# EAGLE design tick-display-mk-4 (EAGLE 6.5.0)
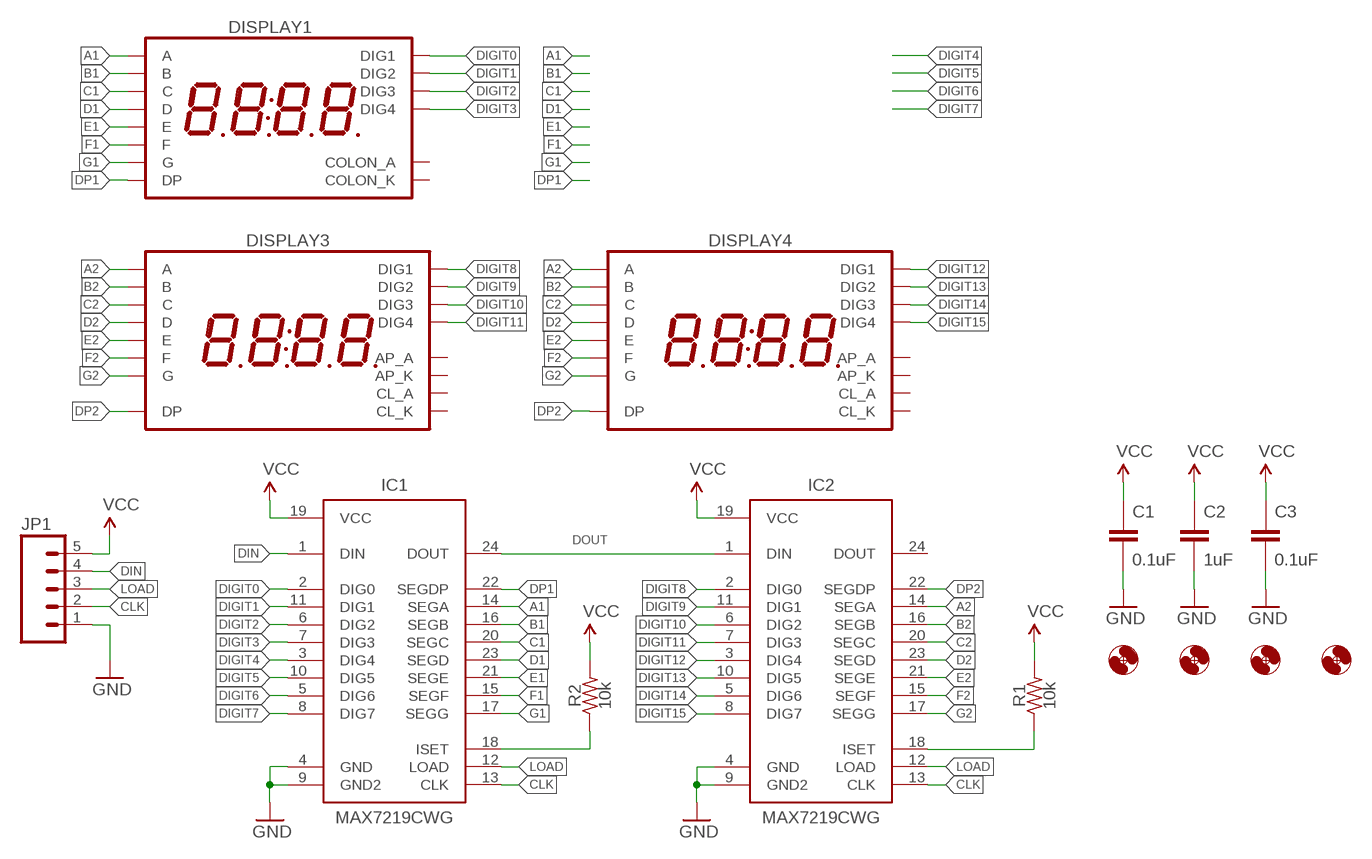
[diagram p0: schematic, sheet 1]

## Parts
C1  0.1uF  CAPACITOR-CERAMIC025-024X044  [C025-024X044]
C2  1uF  CAPACITOR-CERAMIC025-024X044  [C025-024X044]
C3  0.1uF  CAPACITOR-CERAMIC025-024X044  [C025-024X044]
DISPLAY1  7SEG_4DIGIT_COLON14.2MM-CC  [7SEG_4DIG_0.56IN_14MM_ADAFRUIT]
DISPLAY3  7SEG_4DIGIT_COLON_APOS  [7SEG_4DIG_10MM]
DISPLAY4  7SEG_4DIGIT_COLON_APOS  [7SEG_4DIG_10MM]
H1  HOLE#2  [HOLE-#2]
H2  HOLE#2  [HOLE-#2]
H3  HOLE#2  [HOLE-#2]
H4  HOLE#2  [HOLE-#2]
IC1  MAX7219CWG  MAX7219SOIC-W  [SO24W]
IC2  MAX7219CWG  MAX7219SOIC-W  [SO24W]
JP1  M05JST-PH-VERT-PTH  [JST-5-PH-VERT-PTH]
R1  10k  RESISTORPTH-AXIAL-5.08MM  [RESISTOR-AXIAL-PTH-5.08MM]
R2  10k  RESISTORPTH-AXIAL-5.08MM  [RESISTOR-AXIAL-PTH-5.08MM]

## Nets
A1: DISPLAY1.P$13(A) IC1.14(SEGA)
A2: DISPLAY3.14(A) DISPLAY4.14(A) IC2.14(SEGA)
B1: DISPLAY1.P$9(B) IC1.16(SEGB)
B2: DISPLAY3.16(B) DISPLAY4.16(B) IC2.16(SEGB)
C1: DISPLAY1.P$4(C) IC1.20(SEGC)
C2: DISPLAY3.13(C) DISPLAY4.13(C) IC2.20(SEGC)
CLK: IC1.13(CLK) IC2.13(CLK) JP1.2
D1: DISPLAY1.P$2(D) IC1.23(SEGD)
D2: DISPLAY3.3(D) DISPLAY4.3(D) IC2.23(SEGD)
DIGIT0: DISPLAY1.P$14(DIG1) IC1.2(DIG0)
DIGIT1: DISPLAY1.P$11(DIG2) IC1.11(DIG1)
DIGIT2: DISPLAY1.P$10(DIG3) IC1.6(DIG2)
DIGIT3: DISPLAY1.P$6(DIG4) IC1.7(DIG3)
DIGIT4: IC1.3(DIG4)
DIGIT5: IC1.10(DIG5)
DIGIT6: IC1.5(DIG6)
DIGIT7: IC1.8(DIG7)
DIGIT8: DISPLAY3.1(DIG1) IC2.2(DIG0)
DIGIT9: DISPLAY3.2(DIG2) IC2.11(DIG1)
DIGIT10: DISPLAY3.6(DIG3) IC2.6(DIG2)
DIGIT11: DISPLAY3.8(DIG4) IC2.7(DIG3)
DIGIT12: DISPLAY4.1(DIG1) IC2.3(DIG4)
DIGIT13: DISPLAY4.2(DIG2) IC2.10(DIG5)
DIGIT14: DISPLAY4.6(DIG3) IC2.5(DIG6)
DIGIT15: DISPLAY4.8(DIG4) IC2.8(DIG7)
DIN: IC1.1(DIN) JP1.4
DOUT: IC1.24(DOUT) IC2.1(DIN)
DP1: DISPLAY1.P$3(DP) IC1.22(SEGDP)
DP2: DISPLAY3.7(DP) DISPLAY4.7(DP) IC2.22(SEGDP)
E1: DISPLAY1.P$1(E) IC1.21(SEGE)
E2: DISPLAY3.5(E) DISPLAY4.5(E) IC2.21(SEGE)
F1: DISPLAY1.P$12(F) IC1.15(SEGF)
F2: DISPLAY3.11(F) DISPLAY4.11(F) IC2.15(SEGF)
G1: DISPLAY1.P$5(G) IC1.17(SEGG)
G2: DISPLAY3.15(G) DISPLAY4.15(G) IC2.17(SEGG)
GND: C1.2 C2.2 C3.2 IC1.4(GND) IC1.9(GND2) IC2.4(GND) IC2.9(GND2) JP1.1
LOAD: IC1.12(LOAD) IC2.12(LOAD) JP1.3
N$2: IC1.18(ISET) R2.P$1
N$13: IC2.18(ISET) R1.P$1
VCC: C1.1 C2.1 C3.1 IC1.19(VCC) IC2.19(VCC) JP1.5 R1.P$2 R2.P$2
Unconnected: DISPLAY1.P$7(COLON_K) DISPLAY1.P$8(COLON_A) DISPLAY3.4(CL_A) DISPLAY3.9(AP_K) DISPLAY3.10(AP_A) DISPLAY3.12(CL_K) DISPLAY4.4(CL_A) DISPLAY4.9(AP_K) DISPLAY4.10(AP_A) DISPLAY4.12(CL_K) IC2.24(DOUT)

## Library data of the parts
C1-C3 = A_butts:CAPACITOR-CERAMIC: CAPACITOR, European symbol
DISPLAY1 = A_butts:7SEG_4DIGIT_COLON
DISPLAY3 DISPLAY4 = A_butts:7SEG_4DIGIT_COLON_APOS
H1-H4 = A_butts:HOLE: MOUNTING HOLE with drill center marker
IC1 IC2 = A_butts:MAX7219: 8-digit, 8-segment LED display driver, serial input
JP1 = A_butts:M05: Header 5 Standard 5-pin 0.1" header. Use with straight break away headers (SKU : PRT-00116), right angle break away headers (PRT-00553), swiss pins (PRT-00743), machine pins (PRT-00117), and female headers (PRT-00115). Molex polarized connector foot print use with SKU : PRT-08230 with associated crimp pins and housings.
R1 R2 = A_butts:RESISTOR: RESISTOR, American symbol

## Board
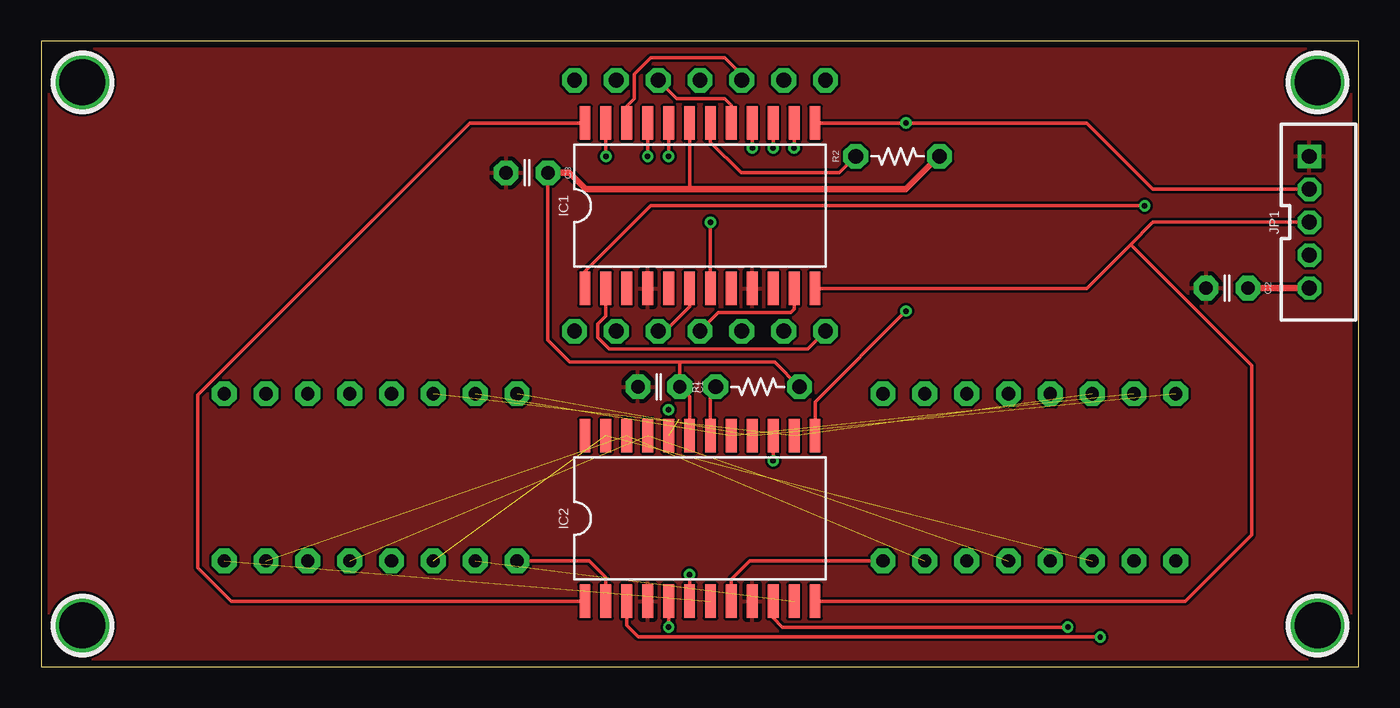
[diagram p1: board, top side]
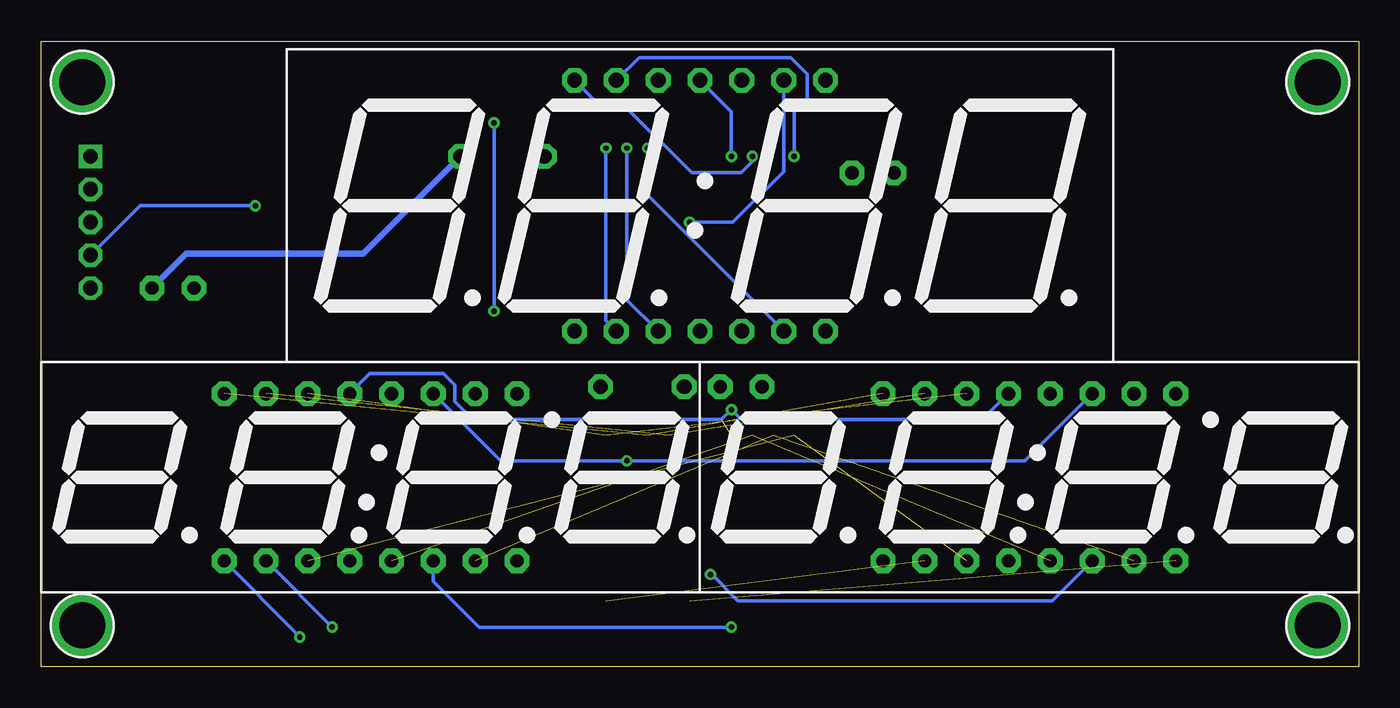
[diagram p2: board, bottom side, seen from below]

Size 80 x 38 mm. Coordinates in mm from the lower left corner, seen from the top.
Outline: 80,0 80,38 0,38 0,0 80,0
Copper layers (1*16): Top 0.0356mm / dielectric 1.5011mm / Bottom 0.0356mm
Design rules "LaenPCBOrder2": minimum track width 6mil, minimum drill 13mil, track to track 6mil, track to pad 6mil, pad to pad 6mil, via to via 6mil, smd to smd 6mil, copper to edge 15mil, drill to drill 6mil, minimum pad ring 7mil, minimum via ring 7mil, stop-mask expansion 3mil, vias tented up to drill 20mil, thermal gap 10mil

### Footprints (pad centres in the part's own frame; a part is rotated, then mirrored left to right if it is on the bottom)
C025-024X044 = drill 0.813 pad 1.5 octagon: 1 -1.27,0; 2 1.27,0
7SEG_4DIG_0.56IN_14MM_ADAFRUIT = drill 0.9 pad 1.5 octagon: P$1 -7.62,7.62; P$2 -5.08,7.62; P$3 -2.54,7.62; P$4 0,7.62; P$5 2.54,7.62; P$6 5.08,7.62; P$7 7.62,7.62; P$8 7.62,-7.62; P$9 5.08,-7.62; P$10 2.54,-7.62; P$11 0,-7.62; P$12 -2.54,-7.62; P$13 -5.08,-7.62; P$14 -7.62,-7.62
7SEG_4DIG_10MM = drill 0.8 pad 1.5 octagon: 1 -8.89,-5.08; 2 -6.35,-5.08; 3 -3.81,-5.08; 4 -1.27,-5.08; 5 1.27,-5.08; 6 3.81,-5.08; 7 6.35,-5.08; 8 8.89,-5.08; 9 8.89,5.08; 10 6.35,5.08; 11 3.81,5.08; 12 1.27,5.08; 13 -1.27,5.08; 14 -3.81,5.08; 15 -6.35,5.08; 16 -8.89,5.08
HOLE-#2 = drill 2.8 pad 3.81: P$1 0,0
SO24W = smd 0.66 x 2.032: 1 -6.985,-5.029; 2 -5.715,-5.029; 3 -4.445,-5.029; 4 -3.175,-5.029; 5 -1.905,-5.029; 6 -0.635,-5.029; 7 0.635,-5.029; 8 1.905,-5.029; 9 3.175,-5.029; 10 4.445,-5.029; 11 5.715,-5.029; 12 6.985,-5.029; 13 6.985,5.029; 14 5.715,5.029; 15 4.445,5.029; 16 3.175,5.029; 17 1.905,5.029; 18 0.635,5.029; 19 -0.635,5.029; 20 -1.905,5.029; 21 -3.175,5.029; 22 -4.445,5.029; 23 -5.715,5.029; 24 -6.985,5.029
JST-5-PH-VERT-PTH = drill 0.9 pad 1.422 square: 1 -4,0 | drill 0.9 pad 1.422 octagon: 2 -2,0; 3 0,0; 4 2,0; 5 4,0
RESISTOR-AXIAL-PTH-5.08MM = drill 0.9 pad 1.5 octagon: P$1 -2.54,0; P$2 2.54,0

### Placement (x,y rotation side)
C1  37.5,17 180 top
C2  72,23 180 top
C3  29.5,30 180 top
DISPLAY1  40,28 0 bottom
DISPLAY3  20,11.5 0 bottom
DISPLAY4  60,11.5 0 bottom
H1  77.5,35.5 0 top
H2  77.5,2.5 0 top
H3  2.5,2.5 0 top
H4  2.5,35.5 0 top
IC1  40,28 0 top
IC2  40,9 0 top
JP1  77,27 270 top
R1  43.5,17 0 top
R2  52,31 0 top

### Tracks (layer width: path | path; a pad name or v marks a point on that pad's centre or on a via)
A1  (via drill 0.33)
  Top 0.2: IC1.14 v45.72,31.5
  Bottom 0.2: v45.72,31.5 45.72,21.02 DISPLAY1.P$13
A2  (2 unrouted)
B1  (via drill 0.33)
  Top 0.2: IC1.16 v43.17,31.5
  Bottom 0.2: v43.17,31.5 43.17,28.64 DISPLAY1.P$9
B2  (2 unrouted)
C1  (via drill 0.33)
  Top 0.2: IC1.20 v38.09,31
  Bottom 0.2: v38.09,31 38.09,33.72 DISPLAY1.P$4
C2  (via drill 0.33)  (1 unrouted)
  Bottom 0.2: DISPLAY3.13 22.85,15 37.5,15 v38.09,15.6 v38.1,15.6 38.7,15 53.8,15 54.9,16.1 54.9,17.1 55.6,17.8 60.05,17.8 DISPLAY4.13
CLK  (via drill 0.33)
  Top 0.2: IC1.13 v52.5,33.03 63.47,33.03 67.5,29 JP1.2 | IC2.13 46.98,16.09 v52.5,21.6
  Bottom 0.2: v52.5,21.6 v52.5,33.03
D1  (via drill 0.33)
  Top 0.2: IC1.23 v34.28,31
  Bottom 0.2: v34.28,31 34.28,33.72 33.5,34.5 33.5,36 34.5,37 43.7,37 DISPLAY1.P$2
D2  (2 unrouted)
DIGIT0
  Top 0.2: IC1.2 34.28,21.29 33.8,20.8 33.8,20 34.5,19.3 46.54,19.3 DISPLAY1.P$14
DIGIT1
  Top 0.2: IC1.11 45.72,21.71 45.5,21.5 41.12,21.5 DISPLAY1.P$11
DIGIT2
  Top 0.2: IC1.6 39.37,21.86 37.88,20.38 DISPLAY1.P$10
DIGIT3  (via drill 0.33)
  Top 0.2: IC1.7 v40.63,27
  Bottom 0.2: DISPLAY1.P$6 34.92,30.08 38,27 v40.63,27
DIGIT8
  Top 0.2: DISPLAY3.1 33.28,6.42 34.28,5.42 IC2.2
DIGIT9  (1 unrouted)
DIGIT10  (via drill 0.33)
  Top 0.2: IC2.6 v39.37,5.6
  Bottom 0.2: v39.37,5.6 39.3,5.6 37.7,4 18.61,4 DISPLAY3.6
DIGIT11  (1 unrouted)
DIGIT12  (via drill 0.33)
  Top 0.2: IC2.3 35.55,2.5 36.26,1.8 v64.3,1.8
  Bottom 0.2: v64.3,1.8 64.5,2.03 DISPLAY4.1
DIGIT13  (via drill 0.33)
  Top 0.2: IC2.10 44.45,2.96 45,2.4 v62.33,2.4
  Bottom 0.2: v62.33,2.4 DISPLAY4.2
DIGIT14  (via drill 0.33)
  Top 0.2: v38.1,2.4 IC2.5
  Bottom 0.2: DISPLAY4.6 56.19,5.19 53.4,2.4 v38.1,2.4
DIGIT15
  Top 0.2: IC2.8 41.91,5.3 43.02,6.42 DISPLAY4.8
DIN  (via drill 0.33)
  Top 0.2: IC1.1 33.02,24.02 37,28 v67,28
  Bottom 0.2: v67,28 74,28 JP1.4
DOUT
  Top 0.2: IC1.24 26.03,33.03 9.5,16.5 9.5,6 11.53,3.97 IC2.1
DP1
  Top 0.2: IC1.22 35.55,34.05 36,34.5 36,36 37,37 41.5,37 42.5,36 42.5,35.66 DISPLAY1.P$3
DP2  (2 unrouted)
E1  (via drill 0.33)
  Top 0.2: IC1.21 v36.83,31
  Bottom 0.2: v36.83,31 36.83,30.68 37.5,30 40.5,30 44.5,34 46,34 DISPLAY1.P$1
E2  (2 unrouted)
F1  (via drill 0.33)
  Top 0.2: IC1.15 v44.45,31.5
  Bottom 0.2: v44.45,31.5 44.45,22.29 DISPLAY1.P$12
F2  (via drill 0.33)
  Top 0.2: IC2.15 v44.45,12.5
  Bottom 0.2: DISPLAY3.11 20.27,12.5 v44.45,12.5 52.11,12.5 DISPLAY4.11
G1
  Top 0.2: IC1.17 41.91,34.09 41.5,34.5 38.58,34.5 DISPLAY1.P$5
G2  (2 unrouted)
GND
  pour Top: 0,38 80,38 80,0 0,0
LOAD
  Top 0.2: IC1.12 63.47,22.97 66.15,25.65 | 66.15,25.65 67.5,27 JP1.3 | IC2.12 69.47,3.97 73.5,8 73.5,18.3 66.15,25.65
N$2
  Top 0.2: R2.P$1 48.46,30 42.5,30 40.63,31.86 IC1.18
N$13
  Top 0.2: R1.P$1 40.63,16.68 IC2.18
VCC
  Top 0.2: C3.1 30.77,19.83 32.1,18.5 38.7,18.5 38.77,18.5 | IC1.19 39.37,29 39.5,29 | R1.P$2 44.54,18.5 38.77,18.5 | IC2.19 39.37,16.41 C1.1 38.77,18.5
  Top 0.4: JP1.5 C2.1 | R2.P$2 54.5,31 52.5,29 39.5,29 33.07,29 32.07,30 C3.1
  Bottom 0.4: C2.1 73.27,23.03 71.2,25.1 60.44,25.1 R2.P$2